# EAGLE design SRAM (EAGLE 6.5.0)
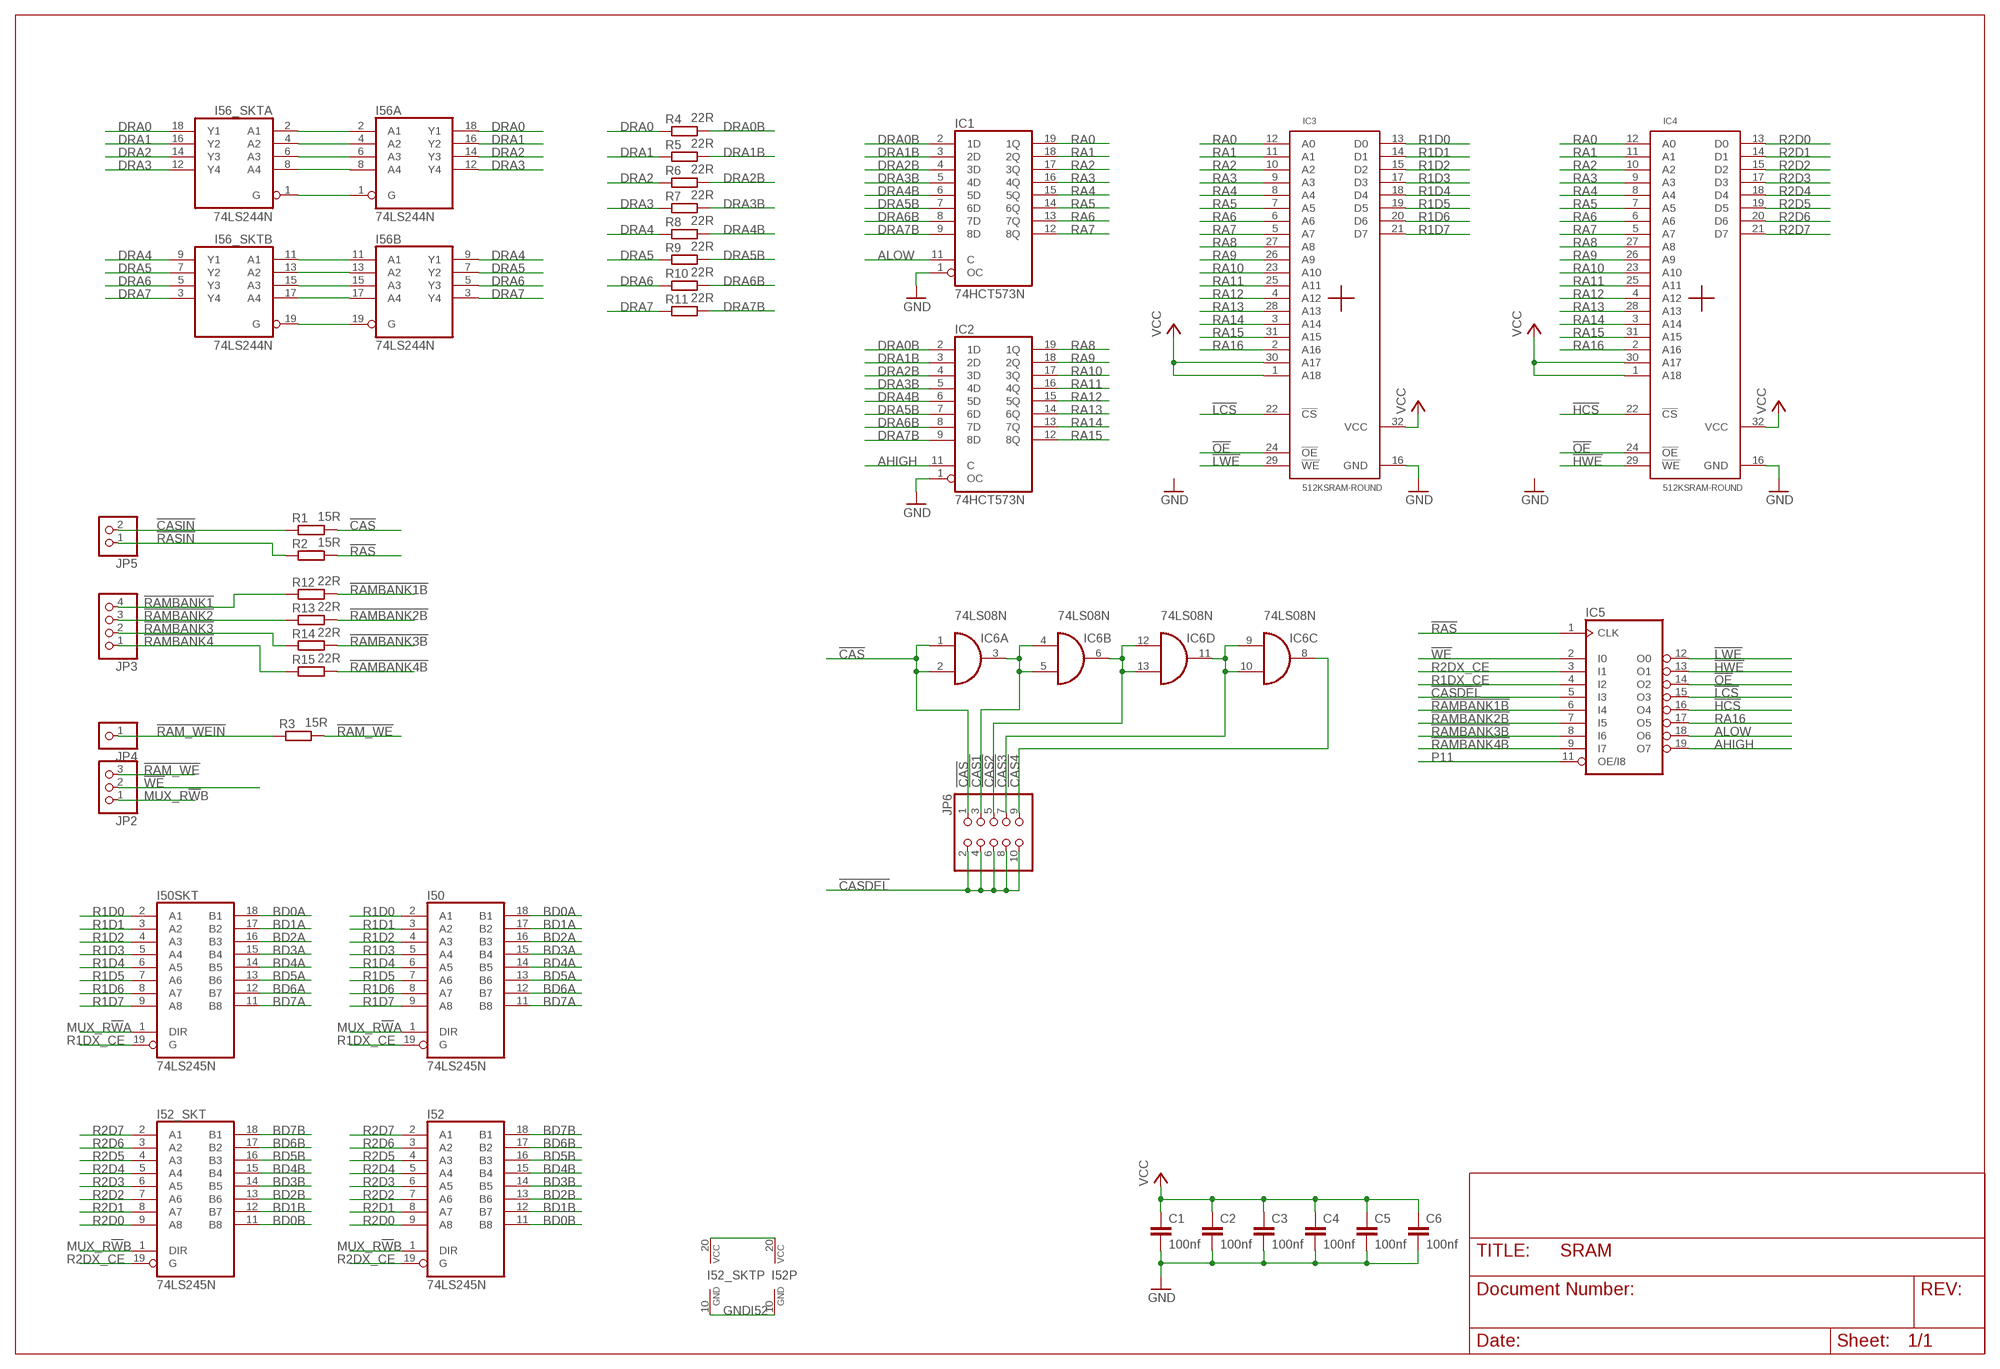
[diagram p0: schematic, sheet 1]

## Parts
C1  100nf  C-EU025-025X050  [C025-025X050]
C2  100nf  C-EU025-025X050  [C025-025X050]
C3  100nf  C-EU025-025X050  [C025-025X050]
C4  100nf  C-EU025-025X050  [C025-025X050]
C5  100nf  C-EU025-025X050  [C025-025X050]
C6  100nf  C-EU025-025X050  [C025-025X050]
I50  74LS245N  [DIL20]
I50SKT  74LS245N  [DIL20]
I52  74LS245N  [DIL20]
I52_SKT  74LS245N  [DIL20]
I56  74LS244N  [DIL20]
I56_SKT  74LS244N  [DIL20]
IC1  74HCT573N  [DIL20]
IC2  74HCT573N  [DIL20]
IC3  512KSRAM-ROUND  [DIL32-ROUND]
IC4  512KSRAM-ROUND  [DIL32-ROUND]
IC5  16V8-ROUND  [DIL20-R]
IC6  74LS08N  [DIL14]
JP2  PINHD-1X3  [1X03]
JP3  PINHD-1X4  [1X04]
JP4  PINHD-1X1  [1X01]
JP5  PINHD-1X2  [1X02]
JP6  PINHD-2X5  [2X05]
R1  15R  R-EU_0204/5  [0204/5]
R2  15R  R-EU_0204/5  [0204/5]
R3  15R  R-EU_0204/5  [0204/5]
R4  22R  R-EU_0204/5  [0204/5]
R5  22R  R-EU_0204/5  [0204/5]
R6  22R  R-EU_0204/5  [0204/5]
R7  22R  R-EU_0204/5  [0204/5]
R8  22R  R-EU_0204/5  [0204/5]
R9  22R  R-EU_0204/5  [0204/5]
R10  22R  R-EU_0204/5  [0204/5]
R11  22R  R-EU_0204/5  [0204/5]
R12  22R  R-EU_0204/5  [0204/5]
R13  22R  R-EU_0204/5  [0204/5]
R14  22R  R-EU_0204/5  [0204/5]
R15  22R  R-EU_0204/5  [0204/5]

## Nets
!CAS: IC6.1(A:I0) IC6.2(A:I1) JP6.1 R1.2
!CAS1: IC6.3(A:O) IC6.4(B:I0) IC6.5(B:I1) JP6.3
!CAS2: IC6.6(B:O) IC6.12(D:I0) IC6.13(D:I1) JP6.5
!CAS3: IC6.9(C:I0) IC6.10(C:I1) IC6.11(D:O) JP6.7
!CAS4: IC6.8(C:O) JP6.9
!CASDEL: IC5.5(I3) JP6.2 JP6.4 JP6.6 JP6.8 JP6.10
!CASIN: JP5.2 R1.1
!HCS: IC4.22(!CS) IC5.16(O4)
!HWE: IC4.29(!WE) IC5.13(O1)
!LCS: IC3.22(!CS) IC5.15(O3)
!LWE: IC3.29(!WE) IC5.12(O0)
!OE: IC3.24(!OE) IC4.24(!OE) IC5.14(O2)
!RAM_WE: JP2.3 R3.2
!RAM_WEIN: JP4.1 R3.1
!RAMBANK1: JP3.4 R12.1
!RAMBANK1B: IC5.6(I4) R12.2
!RAMBANK2: JP3.3 R13.1
!RAMBANK2B: IC5.7(I5) R13.2
!RAMBANK3: JP3.2 R14.1
!RAMBANK3B: IC5.8(I6) R14.2
!RAMBANK4: JP3.1 R15.1
!RAMBANK4B: IC5.9(I7) R15.2
!RAS: IC5.1(CLK) R2.2
!RASIN: JP5.1 R2.1
!WE: IC5.2(I0) JP2.2
AHIGH: IC2.11(C) IC5.19(O7)
ALOW: IC1.11(C) IC5.18(O6)
BD0A: I50.18(B1) I50SKT.18(B1)
BD0B: I52.11(B8) I52_SKT.11(B8)
BD1A: I50.17(B2) I50SKT.17(B2)
BD1B: I52.12(B7) I52_SKT.12(B7)
BD2A: I50.16(B3) I50SKT.16(B3)
BD2B: I52.13(B6) I52_SKT.13(B6)
BD3A: I50.15(B4) I50SKT.15(B4)
BD3B: I52.14(B5) I52_SKT.14(B5)
BD4A: I50.14(B5) I50SKT.14(B5)
BD4B: I52.15(B4) I52_SKT.15(B4)
BD5A: I50.13(B6) I50SKT.13(B6)
BD5B: I52.16(B3) I52_SKT.16(B3)
BD6A: I50.12(B7) I50SKT.12(B7)
BD6B: I52.17(B2) I52_SKT.17(B2)
BD7A: I50.11(B8) I50SKT.11(B8)
BD7B: I52.18(B1) I52_SKT.18(B1)
DRA0: I56.18(A:Y1) I56_SKT.18(A:Y1) R4.1
DRA0B: IC1.2(1D) IC2.2(1D) R4.2
DRA1: I56.16(A:Y2) I56_SKT.16(A:Y2) R5.1
DRA1B: IC1.3(2D) IC2.3(2D) R5.2
DRA2: I56.14(A:Y3) I56_SKT.14(A:Y3) R6.1
DRA2B: IC1.4(3D) IC2.4(3D) R6.2
DRA3: I56.12(A:Y4) I56_SKT.12(A:Y4) R7.1
DRA3B: IC1.5(4D) IC2.5(4D) R7.2
DRA4: I56.9(B:Y1) I56_SKT.9(B:Y1) R8.1
DRA4B: IC1.6(5D) IC2.6(5D) R8.2
DRA5: I56.7(B:Y2) I56_SKT.7(B:Y2) R9.1
DRA5B: IC1.7(6D) IC2.7(6D) R9.2
DRA6: I56.5(B:Y3) I56_SKT.5(B:Y3) R10.1
DRA6B: IC1.8(7D) IC2.8(7D) R10.2
DRA7: I56.3(B:Y4) I56_SKT.3(B:Y4) R11.1
DRA7B: IC1.9(8D) IC2.9(8D) R11.2
GND: C1.2 C2.2 C3.2 C4.2 C5.2 C6.2 IC1.1(OC) IC2.1(OC) IC3.16(GND) IC4.16(GND)
GNDI52: I52.10(GND) I52_SKT.10(GND)
MUX_R!W!A: I50.1(DIR) I50SKT.1(DIR)
MUX_R!W!B: I52.1(DIR) I52_SKT.1(DIR) JP2.1
N$1: I56.11(B:A1) I56_SKT.11(B:A1)
N$2: I56.13(B:A2) I56_SKT.13(B:A2)
N$3: I56.15(B:A3) I56_SKT.15(B:A3)
N$4: I56.17(B:A4) I56_SKT.17(B:A4)
N$5: I56.19(B:G) I56_SKT.19(B:G)
N$6: I56.1(A:G) I56_SKT.1(A:G)
N$7: I56.8(A:A4) I56_SKT.8(A:A4)
N$8: I56.6(A:A3) I56_SKT.6(A:A3)
N$9: I56.4(A:A2) I56_SKT.4(A:A2)
N$10: I56.2(A:A1) I56_SKT.2(A:A1)
P11: IC5.11(OE/I8)
R1D0: I50.2(A1) I50SKT.2(A1) IC3.13(D0)
R1D1: I50.3(A2) I50SKT.3(A2) IC3.14(D1)
R1D2: I50.4(A3) I50SKT.4(A3) IC3.15(D2)
R1D3: I50.5(A4) I50SKT.5(A4) IC3.17(D3)
R1D4: I50.6(A5) I50SKT.6(A5) IC3.18(D4)
R1D5: I50.7(A6) I50SKT.7(A6) IC3.19(D5)
R1D6: I50.8(A7) I50SKT.8(A7) IC3.20(D6)
R1D7: I50.9(A8) I50SKT.9(A8) IC3.21(D7)
R1DX_CE: I50.19(G) I50SKT.19(G) IC5.4(I2)
R2D0: I52.9(A8) I52_SKT.9(A8) IC4.13(D0)
R2D1: I52.8(A7) I52_SKT.8(A7) IC4.14(D1)
R2D2: I52.7(A6) I52_SKT.7(A6) IC4.15(D2)
R2D3: I52.6(A5) I52_SKT.6(A5) IC4.17(D3)
R2D4: I52.5(A4) I52_SKT.5(A4) IC4.18(D4)
R2D5: I52.4(A3) I52_SKT.4(A3) IC4.19(D5)
R2D6: I52.3(A2) I52_SKT.3(A2) IC4.20(D6)
R2D7: I52.2(A1) I52_SKT.2(A1) IC4.21(D7)
R2DX_CE: I52.19(G) I52_SKT.19(G) IC5.3(I1)
RA0: IC1.19(1Q) IC3.12(A0) IC4.12(A0)
RA1: IC1.18(2Q) IC3.11(A1) IC4.11(A1)
RA2: IC1.17(3Q) IC3.10(A2) IC4.10(A2)
RA3: IC1.16(4Q) IC3.9(A3) IC4.9(A3)
RA4: IC1.15(5Q) IC3.8(A4) IC4.8(A4)
RA5: IC1.14(6Q) IC3.7(A5) IC4.7(A5)
RA6: IC1.13(7Q) IC3.6(A6) IC4.6(A6)
RA7: IC1.12(8Q) IC3.5(A7) IC4.5(A7)
RA8: IC2.19(1Q) IC3.27(A8) IC4.27(A8)
RA9: IC2.18(2Q) IC3.26(A9) IC4.26(A9)
RA10: IC2.17(3Q) IC3.23(A10) IC4.23(A10)
RA11: IC2.16(4Q) IC3.25(A11) IC4.25(A11)
RA12: IC2.15(5Q) IC3.4(A12) IC4.4(A12)
RA13: IC2.14(6Q) IC3.28(A13) IC4.28(A13)
RA14: IC2.13(7Q) IC3.3(A14) IC4.3(A14)
RA15: IC2.12(8Q) IC3.31(A15) IC4.31(A15)
RA16: IC3.2(A16) IC4.2(A16) IC5.17(O5)
VCC: C1.1 C2.1 C3.1 C4.1 C5.1 C6.1 IC3.1(A18) IC3.30(A17) IC3.32(VCC) IC4.1(A18) IC4.30(A17) IC4.32(VCC)
VCCI52: I52.20(VCC) I52_SKT.20(VCC)

## Power pins joined to a net without a drawn wire
GND: I50.10(GND) I50SKT.10(GND) I56.10(P:GND) I56_SKT.10(P:GND) IC1.10(GND) IC2.10(GND) IC5.10(GND) IC6.7(P:GND)
VCC: I50.20(VCC) I50SKT.20(VCC) I56.20(P:VCC) I56_SKT.20(P:VCC) IC1.20(VCC) IC2.20(VCC) IC5.20(VCC) IC6.14(P:VCC)

## Library data of the parts
C1-C6 = rcl:C-EU: CAPACITOR, European symbol
I50 I50SKT I52 I52_SKT = 74xx-eu-round:74*245: Octal BUS TRANSCEIVER, 3-state
I56 I56_SKT = 74xx-eu-round:74*244: Octal BUFFER and LINE DRIVER, 3-state
IC1 IC2 = 74xx-eu-round:74*573: 8-bit D latch BUS DRIVER
IC3 IC4 = Rom-Ram:512KSRAM: 512K x 8 SRAM
IC5 = pal-phs:16V8: PAL
IC6 = 74xx-eu-round:74*08: Quad 2-input AND gate
JP2 = pinhead-round:PINHD-1X3: PIN HEADER
JP3 = pinhead-round:PINHD-1X4: PIN HEADER
JP4 = pinhead-round:PINHD-1X1: PIN HEADER
JP5 = pinhead-round:PINHD-1X2: PIN HEADER
JP6 = pinhead-round:PINHD-2X5: PIN HEADER
R1-R15 = rcl:R-EU_: RESISTOR, European symbol

## Board
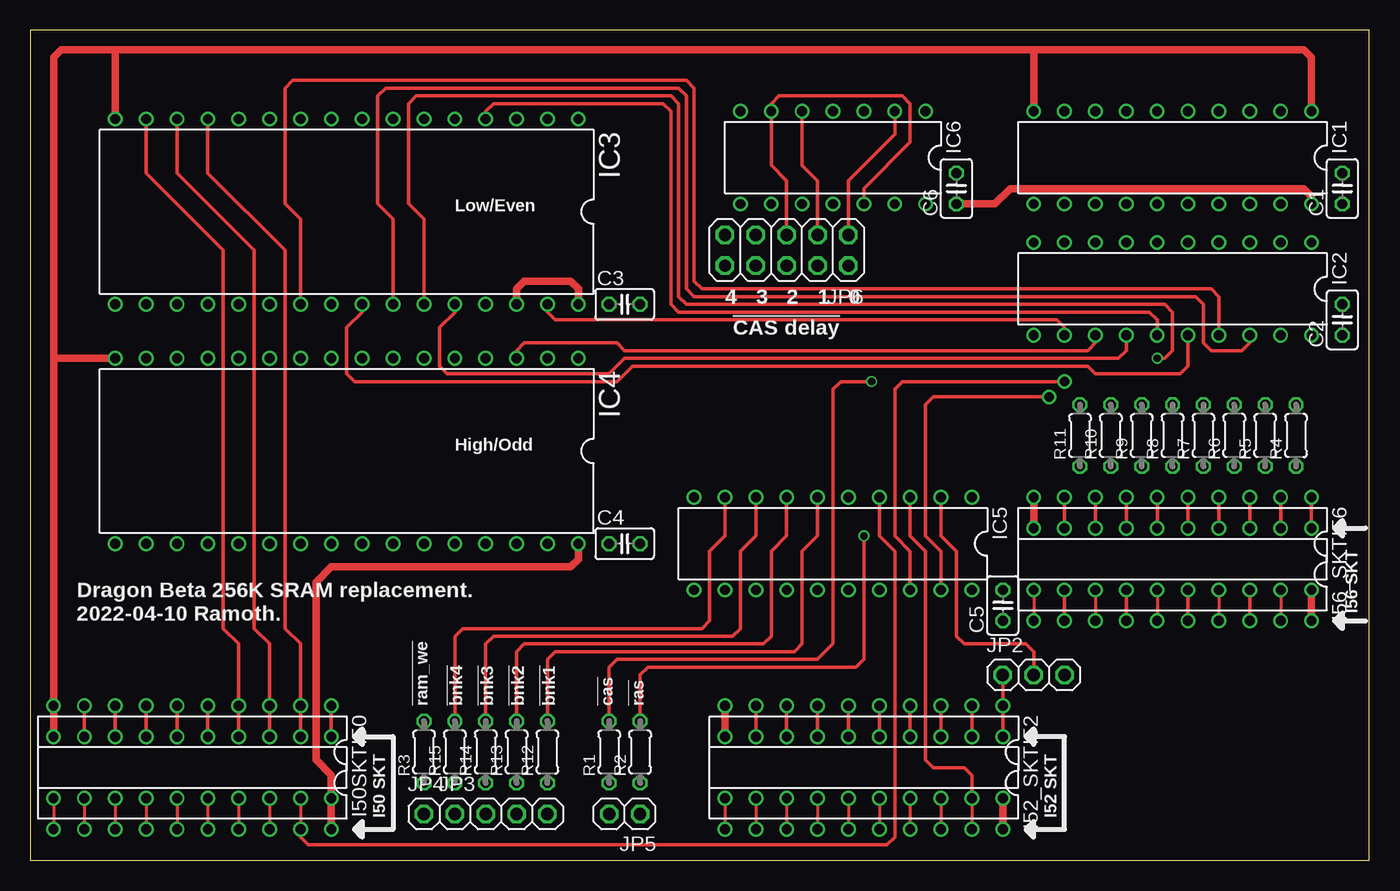
[diagram p1: board, top side]
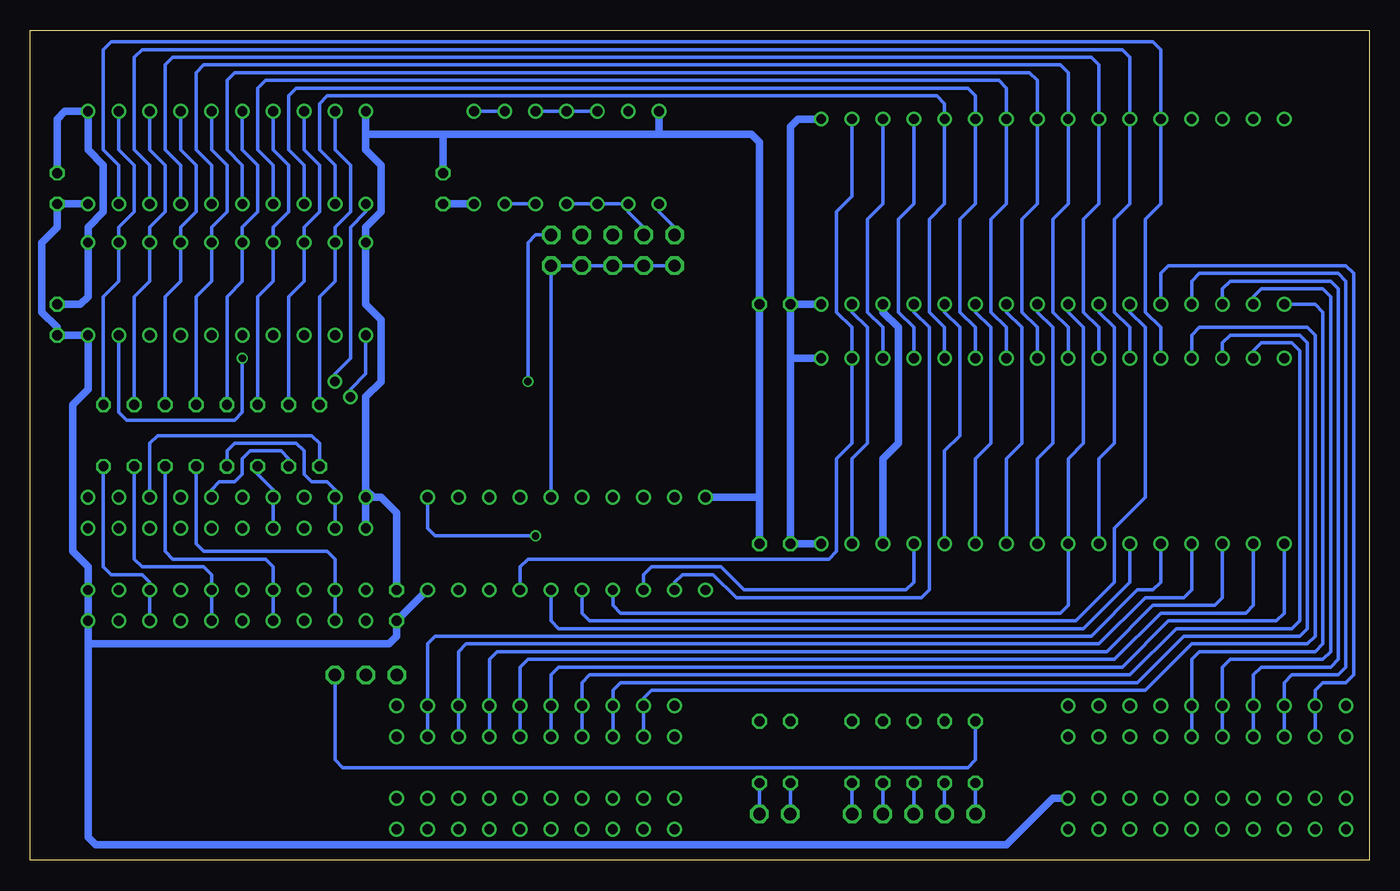
[diagram p2: board, bottom side, seen from below]

Size 110.15 x 68.25 mm. Coordinates in mm from the lower left corner, seen from the top.
Outline: 0,0 110.15,0 110.15,68.25 0,68.25 0,0
Copper layers (1*16): Top 0.035559375mm / dielectric 1.6mm / Bottom 0.035559375mm
Design rules "oshpark-2layer": minimum track width 6mil, minimum drill 10mil, track to track 6mil, track to pad 6mil, pad to pad 6mil, via to via 6mil, smd to smd 6mil, copper to edge 15mil, drill to drill 6mil, minimum pad ring 5mil, minimum via ring 5mil, stop-mask expansion 2.5mil, vias tented up to drill 0mil, thermal gap 10mil

### Footprints (pad centres in the part's own frame; a part is rotated, then mirrored left to right if it is on the bottom)
C025-025X050 = drill 0.813 octagon: 1 -1.27,0; 2 1.27,0
DIL20 = drill 0.813: 1 -11.43,-3.81; 2 -8.89,-3.81; 3 -6.35,-3.81; 4 -3.81,-3.81; 5 -1.27,-3.81; 6 1.27,-3.81; 7 3.81,-3.81; 8 6.35,-3.81; 9 8.89,-3.81; 10 11.43,-3.81; 11 11.43,3.81; 12 8.89,3.81; 13 6.35,3.81; 14 3.81,3.81; 15 1.27,3.81; 16 -1.27,3.81; 17 -3.81,3.81; 18 -6.35,3.81; 19 -8.89,3.81; 20 -11.43,3.81
DIL32-ROUND = drill 0.813: 1 -19.05,-7.62; 2 -16.51,-7.62; 3 -13.97,-7.62; 4 -11.43,-7.62; 5 -8.89,-7.62; 6 -6.35,-7.62; 7 -3.81,-7.62; 8 -1.27,-7.62; 9 1.27,-7.62; 10 3.81,-7.62; 11 6.35,-7.62; 12 8.89,-7.62; 13 11.43,-7.62; 14 13.97,-7.62; 15 16.51,-7.62; 16 19.05,-7.62; 17 19.05,7.62; 18 16.51,7.62; 19 13.97,7.62; 20 11.43,7.62; 21 8.89,7.62; 22 6.35,7.62; 23 3.81,7.62; 24 1.27,7.62; 25 -1.27,7.62; 26 -3.81,7.62; 27 -6.35,7.62; 28 -8.89,7.62; 29 -11.43,7.62; 30 -13.97,7.62; 31 -16.51,7.62; 32 -19.05,7.62
DIL20-R = drill 0.813: 1 -11.43,-3.81; 2 -8.89,-3.81; 3 -6.35,-3.81; 4 -3.81,-3.81; 5 -1.27,-3.81; 6 1.27,-3.81; 7 3.81,-3.81; 8 6.35,-3.81; 9 8.89,-3.81; 10 11.43,-3.81; 11 11.43,3.81; 12 8.89,3.81; 13 6.35,3.81; 14 3.81,3.81; 15 1.27,3.81; 16 -1.27,3.81; 17 -3.81,3.81; 18 -6.35,3.81; 19 -8.89,3.81; 20 -11.43,3.81
DIL14 = drill 0.813: 1 -7.62,-3.81; 2 -5.08,-3.81; 3 -2.54,-3.81; 4 0,-3.81; 5 2.54,-3.81; 6 5.08,-3.81; 7 7.62,-3.81; 8 7.62,3.81; 9 5.08,3.81; 10 2.54,3.81; 11 0,3.81; 12 -2.54,3.81; 13 -5.08,3.81; 14 -7.62,3.81
1X03 = drill 1.016 octagon: 1 -2.54,0; 2 0,0; 3 2.54,0
1X04 = drill 1.016 octagon: 1 -3.81,0; 2 -1.27,0; 3 1.27,0; 4 3.81,0
1X01 = drill 1.016 octagon: 1 0,0
1X02 = drill 1.016 octagon: 1 -1.27,0; 2 1.27,0
2X05 = drill 1.016 octagon: 1 -5.08,-1.27; 2 -5.08,1.27; 3 -2.54,-1.27; 4 -2.54,1.27; 5 0,-1.27; 6 0,1.27; 7 2.54,-1.27; 8 2.54,1.27; 9 5.08,-1.27; 10 5.08,1.27
0204/5 = drill 0.813 octagon: 1 -2.54,0; 2 2.54,0

### Placement (x,y rotation side)
C1  107.95,55.24 90 top
C2  107.95,44.45 90 top
C3  48.9,45.72 0 top
C4  48.9,26.04 0 top
C5  80.01,20.95 90 top
C6  76.2,55.24 90 top
I50  13.34,8.89 180 top
I50SKT  13.34,6.35 180 top
I52  68.58,8.89 180 top
I52_SKT  68.58,6.35 180 top
I56  93.98,26.04 180 top
I56_SKT  93.98,23.5 180 top
IC1  93.98,57.78 180 top
IC2  93.98,46.99 180 top
IC3  26.04,53.34 180 top
IC4  26.04,33.66 180 top
IC5  66.04,26.04 180 top
IC6  66.04,57.78 180 top
JP2  82.55,15.24 0 top
JP3  38.73,3.81 0 top
JP4  32.38,3.81 0 top
JP5  48.9,3.81 180 top
JP6  62.23,50.16 180 top
R1  47.62,8.89 90 top
R2  50.16,8.89 90 top
R3  32.38,8.89 90 top
R4  104.14,34.92 90 top
R5  101.6,34.92 90 top
R6  99.06,34.92 90 top
R7  96.52,34.92 90 top
R8  93.98,34.92 90 top
R9  91.44,34.92 90 top
R10  88.9,34.92 90 top
R11  86.36,34.92 90 top
R12  42.55,8.89 90 top
R13  40.01,8.89 90 top
R14  37.47,8.89 90 top
R15  34.92,8.89 90 top

### Tracks (layer width: path | path; a pad name or v marks a point on that pad's centre or on a via)
!CAS  (via drill 0.6)
  Top 0.305: IC6.2 71.12,59.69 67.31,55.88 JP6.1 | R1.2 47.62,15.88 48.26,16.51 64.77,16.51 66.04,17.78 66.04,38.73 66.67,39.37 v69.22,39.37
  Bottom 0.305: IC6.2 IC6.1 | v69.22,39.37 69.22,50.8 68.58,51.44 JP6.1
!CAS1
  Top 0.305: IC6.5 63.5,57.15 64.77,55.88 JP6.3
  Bottom 0.305: IC6.5 IC6.4 IC6.3
!CAS2
  Top 0.305: JP6.5 62.23,55.88 60.96,57.15 IC6.6 60.96,62.23 61.59,62.87 71.75,62.87 72.39,62.23 72.39,59.05 68.58,55.24 IC6.12
  Bottom 0.305: IC6.12 IC6.13
!CAS3
  Bottom 0.305: IC6.11 IC6.10 IC6.9 60.96,53.34 59.69,52.07 JP6.7
!CAS4
  Bottom 0.305: JP6.9 57.15,52.07 58.42,53.34 IC6.8
!CASDEL
  Bottom 0.305: JP6.10 JP6.8 JP6.6 JP6.4 JP6.2 IC5.5
!CASIN
  Bottom 0.305: JP5.2 R1.1
!HCS
  Bottom 0.305: IC4.22 19.68,22.86 23.5,19.05 66.67,19.05 67.31,19.68 IC5.16
!HWE
  Bottom 0.305: IC4.29 37.47,22.86 38.1,22.23 51.44,22.23 53.34,24.13 59.05,24.13 59.69,23.5 IC5.13
!LCS
  Bottom 0.305: IC3.22 19.68,45.09 18.41,43.81 18.41,29.84 20.95,27.3 20.95,22.86 24.13,19.68 64.14,19.68 64.77,20.32 IC5.15
!LWE
  Bottom 0.305: IC3.29 37.47,45.09 36.2,43.81 36.2,22.23 36.83,21.59 52.07,21.59 53.98,23.5 56.52,23.5 57.15,22.86 IC5.12
!OE
  Bottom 0.305: IC3.24 24.77,45.09 23.5,43.81 23.5,34.29 24.77,33.02 IC4.24 24.77,20.95 25.4,20.32 61.59,20.32 62.23,20.95 IC5.14
!RAM_WE
  Bottom 0.305: JP2.3 85.09,8.26 84.45,7.62 33.02,7.62 32.38,8.26 R3.2
!RAM_WEIN
  Bottom 0.305: JP4.1 R3.1
!RAMBANK1
  Bottom 0.305: JP3.4 R12.1
!RAMBANK1B
  Top 0.305: R12.2 42.55,16.51 43.18,17.14 62.87,17.14 63.5,17.78 63.5,25.4 64.77,26.67 IC5.6
!RAMBANK2
  Bottom 0.305: JP3.3 R13.1
!RAMBANK2B
  Top 0.305: R13.2 40.01,17.14 40.64,17.78 60.33,17.78 60.96,18.41 60.96,25.4 62.23,26.67 IC5.7
!RAMBANK3
  Bottom 0.305: JP3.2 R14.1
!RAMBANK3B
  Top 0.305: R14.2 37.47,17.78 38.1,18.41 57.78,18.41 58.42,19.05 58.42,25.4 59.69,26.67 IC5.8
!RAMBANK4
  Bottom 0.305: JP3.1 R15.1
!RAMBANK4B
  Top 0.305: R15.2 34.92,18.41 35.56,19.05 55.24,19.05 55.88,19.68 55.88,25.4 57.15,26.67 IC5.9
!RAS  (via drill 0.6)
  Top 0.305: R2.2 50.16,15.24 50.8,15.88 67.94,15.88 68.58,16.51 v68.58,26.67
  Bottom 0.305: v68.58,26.67 76.83,26.67 77.47,27.3 IC5.1
!RASIN
  Bottom 0.305: JP5.1 R2.1
!WE
  Top 0.305: IC5.2 74.93,26.67 76.2,25.4 76.2,18.41 76.83,17.78 81.92,17.78 82.55,17.14 JP2.2
AHIGH  (via drill 0.8)
  Top 0.305: v83.82,38.1 74.3,38.1 73.66,37.47 73.66,26.67 74.93,25.4 IC5.19
  Bottom 0.305: v83.82,38.1 83.82,38.73 82.55,40.01 IC2.11
ALOW  (via drill 0.8)
  Top 0.305: v85.09,39.37 71.75,39.37 71.12,38.73 71.12,26.67 72.39,25.4 IC5.18
  Bottom 0.305: IC1.11 82.55,53.34 83.82,52.07 83.82,41.27 85.09,40.01 v85.09,39.37
BD0A
  Top 0.254: I50.18 I50SKT.18
BD0B
  Top 0.254: I52.11 I52_SKT.11
BD1A
  Top 0.254: I50.17 I50SKT.17
BD1B
  Top 0.254: I52.12 I52_SKT.12
BD2A
  Top 0.254: I50.16 I50SKT.16
BD2B
  Top 0.254: I52.13 I52_SKT.13
BD3A
  Top 0.254: I50.15 I50SKT.15
BD3B
  Top 0.254: I52.14 I52_SKT.14
BD4A
  Top 0.254: I50.14 I50SKT.14
BD4B
  Top 0.254: I52.15 I52_SKT.15
BD5A
  Top 0.254: I50.13 I50SKT.13
BD5B
  Top 0.254: I52.16 I52_SKT.16
BD6A
  Top 0.254: I50.12 I50SKT.12
BD6B
  Top 0.254: I52.17 I52_SKT.17
BD7A
  Top 0.254: I50.11 I50SKT.11
BD7B
  Top 0.254: I52.18 I52_SKT.18
DRA0
  Top 0.305: I56_SKT.18 I56.18
  Bottom 0.305: I56_SKT.18 I56.18 100.33,22.86 100.97,23.5 103.5,23.5 104.14,24.13 R4.1
DRA0B
  Bottom 0.305: R4.2 104.14,46.35 102.87,47.62 IC2.2 102.87,52.07 101.6,53.34 101.6,57.15 102.87,58.42 IC1.2
DRA1
  Top 0.305: I56_SKT.16 I56.16
  Bottom 0.305: I56_SKT.16 I56.16 95.25,23.5 95.89,24.13 100.97,24.13 101.6,24.77 R5.1
DRA1B
  Bottom 0.305: R5.2 101.6,46.35 100.33,47.62 IC2.3 100.33,52.07 99.06,53.34 99.06,57.15 100.33,58.42 IC1.3
DRA2
  Top 0.305: I56_SKT.14 I56.14
  Bottom 0.305: I56_SKT.14 I56.14 90.17,24.13 90.81,24.77 98.42,24.77 99.06,25.4 R6.1
DRA2B
  Bottom 0.305: R6.2 99.06,46.35 97.79,47.62 IC2.4 97.79,52.07 96.52,53.34 96.52,57.15 97.79,58.42 IC1.4
DRA3
  Top 0.305: I56_SKT.12 I56.12
  Bottom 0.305: I56_SKT.12 I56.12 85.09,24.77 85.72,25.4 95.89,25.4 96.52,26.04 R7.1
DRA3B
  Bottom 0.305: R7.2 96.52,46.35 95.25,47.62 IC2.5 95.25,52.07 93.98,53.34 93.98,57.15 95.25,58.42 IC1.5
DRA4
  Top 0.305: I56.9 I56_SKT.9
  Bottom 0.305: I56_SKT.9 I56.9 85.09,30.48 85.72,31.11 87,31.11 87.63,31.75 87.63,33.66 88.27,34.29 93.34,34.29 93.98,33.66 R8.1
DRA4B
  Bottom 0.305: R8.2 93.98,46.35 92.71,47.62 IC2.6 92.71,52.07 91.44,53.34 91.44,57.15 92.71,58.42 IC1.6
DRA5
  Top 0.305: I56_SKT.7 I56.7
  Bottom 0.305: I56_SKT.7 I56.7 90.17,30.48 91.44,31.75 R9.1
DRA5B
  Bottom 0.305: R9.2 91.44,46.35 90.17,47.62 IC2.7 90.17,52.07 88.9,53.34 88.9,57.15 90.17,58.42 IC1.7
DRA6
  Top 0.305: I56_SKT.5 I56.5
  Bottom 0.305: R10.1 88.9,33.02 89.53,33.66 92.08,33.66 92.71,33.02 92.71,31.75 93.34,31.11 94.61,31.11 95.25,30.48 I56.5
DRA6B
  Bottom 0.305: R10.2 88.9,46.35 87.63,47.62 IC2.8 87.63,52.07 86.36,53.34 86.36,57.15 87.63,58.42 IC1.8
DRA7
  Top 0.305: I56_SKT.3 I56.3
  Bottom 0.305: R11.1 86.36,34.29 87,34.92 99.69,34.92 100.33,34.29 I56.3
DRA7B
  Bottom 0.305: R11.2 86.36,46.35 85.09,47.62 IC2.9 85.09,52.07 83.82,53.34 83.82,57.15 85.09,58.42 IC1.9
GND
  Top 0.61: I50SKT.10 I50.10 1.91,41.27 | I56_SKT.10 I56.10 | 1.91,41.27 1.91,66.04 2.54,66.67 6.99,66.67 | IC1.1 105.41,66.04 104.78,66.67 82.55,66.67 | 82.55,66.67 6.99,66.67 | IC3.16 6.99,66.67 | IC1.10 82.55,66.67 | IC4.16 1.91,41.27
  Bottom 0.61: 50.16,29.84 C3.2 50.16,59.05 50.8,59.69 58.42,59.69 | 50.16,29.84 C4.2 | 58.42,59.69 76.2,59.69 | 76.2,59.69 82.55,59.69 | 82.55,30.48 82.55,38.1 81.28,39.37 81.28,44.45 82.55,45.72 IC2.10 82.55,52.07 81.28,53.34 81.28,57.15 82.55,58.42 82.55,59.69 | 82.55,30.48 I56.10 I56_SKT.10 | C5.2 80.01,28.57 81.28,29.84 81.92,29.84 82.55,30.48 | C1.2 107.95,60.96 107.31,61.59 IC1.1 105.41,58.42 104.14,57.15 104.14,53.34 105.41,52.07 IC2.1 105.41,46.35 106.05,45.72 C2.2 | IC5.10 50.16,29.84 | 82.55,59.69 IC1.10 | C6.2 76.2,59.69 | IC6.7 58.42,59.69
GNDI52
  Top 0.61: I52.10 I52_SKT.10
MUX_R!W!A
  Top 0.305: I50.1 I50SKT.1
MUX_R!W!B
  Top 0.305: I52_SKT.1 I52.1 JP2.1
N$1
  Top 0.254: I56.11 I56_SKT.11
N$2
  Top 0.254: I56.13 I56_SKT.13
N$3
  Top 0.254: I56.15 I56_SKT.15
N$4
  Top 0.254: I56.17 I56_SKT.17
N$5
  Top 0.254: I56.19 I56_SKT.19
N$6
  Top 0.305: I56_SKT.1 I56.1
N$7
  Top 0.305: I56_SKT.8 I56.8
N$8
  Top 0.305: I56_SKT.6 I56.6
N$9
  Top 0.305: I56_SKT.4 I56.4
N$10
  Top 0.305: I56_SKT.2 I56.2
R1D0
  Top 0.305: I50SKT.2 I50.2 22.23,17.78 20.95,19.05 20.95,50.16 14.61,56.52 IC3.13
R1D1
  Top 0.305: I50SKT.3 I50.3 19.68,17.78 18.41,19.05 18.41,50.16 12.06,56.52 IC3.14
R1D2
  Top 0.305: I50SKT.4 I50.4 17.14,17.78 15.88,19.05 15.88,50.16 9.53,56.52 IC3.15
R1D3
  Top 0.305: I50SKT.5 I50.5
  Bottom 0.305: IC3.17 4.45,45.72 3.81,45.09 3.81,17.78 4.45,17.14 13.97,17.14 14.61,16.51 I50.5 I50SKT.5
R1D4
  Top 0.305: I50SKT.6 I50.6
  Bottom 0.305: IC3.18 9.53,46.35 8.89,46.99 3.81,46.99 3.17,46.35 3.17,17.14 3.81,16.51 11.43,16.51 12.06,15.88 I50.6 I50SKT.6
R1D5
  Top 0.305: I50SKT.7 I50.7
  Bottom 0.305: IC3.19 12.06,46.99 11.43,47.62 3.17,47.62 2.54,46.99 2.54,16.51 3.17,15.88 8.89,15.88 9.53,15.24 I50.7 I50SKT.7
R1D6
  Top 0.305: I50SKT.8 I50.8
  Bottom 0.305: IC3.20 14.61,47.62 13.97,48.26 2.54,48.26 1.91,47.62 1.91,15.88 2.54,15.24 6.35,15.24 6.99,14.61 I50.8 I50SKT.8
R1D7
  Top 0.305: I50SKT.9 I50.9
  Bottom 0.305: IC3.21 17.14,48.26 16.51,48.9 1.91,48.9 1.27,48.26 1.27,15.24 1.91,14.61 3.81,14.61 4.45,13.97 I50.9 I50SKT.9
R1DX_CE
  Top 0.254: I50.19 I50SKT.19
  Top 0.305: I50SKT.19 22.23,1.91 22.86,1.27 70.48,1.27 71.12,1.91 71.12,25.4 69.85,26.67 IC5.4
R2D0
  Top 0.305: I52.9 I52_SKT.9
  Bottom 0.305: I52_SKT.9 I52.9 59.69,13.34 59.05,13.97 18.41,13.97 14.61,17.78 5.08,17.78 4.45,18.41 4.45,43.18 5.08,43.81 13.97,43.81 14.61,43.18 IC4.13
R2D1
  Top 0.305: I52.8 I52_SKT.8
  Bottom 0.305: I52_SKT.8 I52.8 62.23,13.97 61.59,14.61 19.05,14.61 15.24,18.41 5.71,18.41 5.08,19.05 5.08,42.55 5.71,43.18 11.43,43.18 12.06,42.55 IC4.14
R2D2
  Top 0.305: I52.7 I52_SKT.7
  Bottom 0.305: I52_SKT.7 I52.7 64.77,14.61 64.14,15.24 19.68,15.24 15.88,19.05 6.35,19.05 5.71,19.68 5.71,41.91 6.35,42.55 8.89,42.55 9.53,41.91 IC4.15
R2D3
  Top 0.305: I52.6 I52_SKT.6
  Bottom 0.305: IC4.17 6.99,20.32 7.62,19.68 16.51,19.68 20.32,15.88 66.67,15.88 67.31,15.24 I52.6 I52_SKT.6
R2D4
  Top 0.305: I52.5 I52_SKT.5
  Bottom 0.305: IC4.18 9.53,20.95 10.16,20.32 17.14,20.32 20.95,16.51 69.22,16.51 69.85,15.88 I52.5 I52_SKT.5
R2D5
  Top 0.305: I52.4 I52_SKT.4
  Bottom 0.305: IC4.19 12.06,21.59 12.7,20.95 17.78,20.95 21.59,17.14 71.75,17.14 72.39,16.51 I52.4 I52_SKT.4
R2D6
  Top 0.305: I52.3 I52_SKT.3
  Bottom 0.305: IC4.20 14.61,22.23 15.24,21.59 18.41,21.59 22.23,17.78 74.3,17.78 74.93,17.14 I52.3 I52_SKT.3
R2D7
  Top 0.305: I52.2 I52_SKT.2
  Bottom 0.305: IC4.21 17.14,22.86 17.78,22.23 19.05,22.23 22.86,18.41 76.83,18.41 77.47,17.78 I52.2 I52_SKT.2
R2DX_CE
  Top 0.254: I52.19 I52_SKT.19
  Top 0.305: IC5.3 72.39,26.67 73.66,25.4 73.66,8.26 74.3,7.62 76.83,7.62 77.47,6.99 I52.19
RA0
  Bottom 0.305: IC1.19 102.87,57.15 104.14,58.42 104.14,66.67 103.5,67.31 17.78,67.31 17.14,66.67 IC3.12 17.14,53.98 18.41,52.7 18.41,45.09 17.14,43.81 IC4.12
RA1
  Bottom 0.305: IC1.18 100.33,57.15 101.6,58.42 101.6,66.04 100.97,66.67 20.32,66.67 19.68,66.04 IC3.11 19.68,53.98 20.95,52.7 20.95,45.09 19.68,43.81 IC4.11
RA2
  Bottom 0.305: IC1.17 97.79,57.15 99.06,58.42 99.06,65.41 98.42,66.04 22.86,66.04 22.23,65.41 IC3.10 22.23,53.98 23.5,52.7 23.5,45.09 22.23,43.81 IC4.10
RA3
  Bottom 0.305: IC1.16 95.25,57.15 96.52,58.42 96.52,64.77 95.89,65.41 25.4,65.41 24.77,64.77 IC3.9 24.77,53.98 26.04,52.7 26.04,45.09 24.77,43.81 IC4.9
RA4
  Bottom 0.305: IC1.15 92.71,57.15 93.98,58.42 93.98,64.14 93.34,64.77 27.94,64.77 27.3,64.14 IC3.8 27.3,53.98 28.57,52.7 28.57,45.09 27.3,43.81 IC4.8
RA5
  Bottom 0.305: IC1.14 90.17,57.15 91.44,58.42 91.44,63.5 90.81,64.14 30.48,64.14 29.84,63.5 IC3.7 29.84,53.98 31.11,52.7 31.11,45.09 29.84,43.81 IC4.7
RA6
  Bottom 0.305: IC1.13 87.63,57.15 88.9,58.42 88.9,62.87 88.27,63.5 33.02,63.5 32.38,62.87 IC3.6 32.38,53.98 33.66,52.7 33.66,45.09 32.38,43.81 IC4.6
RA7
  Bottom 0.305: IC1.12 85.09,57.15 86.36,58.42 86.36,62.23 85.72,62.87 35.56,62.87 34.92,62.23 IC3.5 34.92,53.98 36.2,52.7 36.2,45.09 34.92,43.81 IC4.5
RA8  (via drill 0.6)
  Top 0.305: v92.71,41.27 93.34,41.27 93.98,41.91 93.98,45.09 93.34,45.72 53.98,45.72 53.34,46.35 53.34,62.23 52.7,62.87 31.75,62.87 31.11,62.23 31.11,53.98 32.38,52.7 IC3.27
  Bottom 0.305: IC3.27 32.38,45.09 31.11,43.81 31.11,34.29 32.38,33.02 IC4.27 | IC2.19 102.87,36.83 102.23,36.2 93.34,36.2 92.71,36.83 v92.71,41.27
RA9
  Top 0.305: IC2.18 100.33,42.55 99.69,41.91 97.16,41.91 96.52,42.55 96.52,45.72 95.89,46.35 54.61,46.35 53.98,46.99 53.98,62.87 53.34,63.5 29.21,63.5 28.57,62.87 28.57,53.98 29.84,52.7 IC3.26
  Bottom 0.305: IC3.26 29.84,45.09 28.57,43.81 28.57,34.29 29.84,33.02 IC4.26
RA10
  Top 0.305: IC2.17 97.79,46.35 97.16,46.99 55.24,46.99 54.61,47.62 54.61,63.5 53.98,64.14 21.59,64.14 20.95,63.5 20.95,53.98 22.23,52.7 IC3.23
  Bottom 0.305: IC3.23 22.23,45.09 20.95,43.81 20.95,34.29 22.23,33.02 IC4.23
RA11
  Top 0.305: IC2.16 95.25,40.64 94.61,40.01 87.63,40.01 87,40.64 49.53,40.64 48.26,39.37 26.67,39.37 26.04,40.01 26.04,43.81 27.3,45.09 IC3.25
  Bottom 0.305: IC3.25 27.3,45.09 26.04,43.81 26.04,34.29 27.3,33.02 IC4.25
RA12
  Top 0.305: IC2.15 92.71,44.45 92.08,45.09 53.34,45.09 52.7,45.72 52.7,61.59 52.07,62.23 38.1,62.23 37.47,61.59 IC3.4
  Bottom 0.305: IC3.4 37.47,53.98 38.73,52.7 38.73,45.09 37.47,43.81 IC4.4
RA13
  Top 0.305: IC2.14 90.17,41.91 89.53,41.27 48.9,41.27 47.62,40.01 34.29,40.01 33.66,40.64 33.66,43.81 34.92,45.09 IC3.28
  Bottom 0.305: IC3.28 34.92,45.09 33.66,43.81 33.66,34.92 34.92,33.66 IC4.28
RA14
  Top 0.305: IC2.13 87.63,42.55 87,41.91 48.9,41.91 48.26,42.55 40.64,42.55 40.01,41.91 IC4.3
  Bottom 0.305: IC3.3 40.01,53.98 41.27,52.7 41.27,45.09 40.01,43.81 IC4.3
RA15
  Top 0.305: IC2.12 85.09,43.81 84.45,44.45 43.18,44.45 42.55,45.09 IC3.31
  Bottom 0.305: IC3.31 42.55,45.09 41.27,43.81 41.27,34.29 42.55,33.02 IC4.31
RA16
  Bottom 0.305: IC3.2 42.55,54.61 43.81,53.34 43.81,45.09 42.55,43.81 IC4.2 42.55,34.29 43.81,33.02 43.81,25.4 44.45,24.77 69.22,24.77 69.85,24.13 IC5.17
VCC
  Top 0.61: I56.20 I56_SKT.20 | I50SKT.20 I50.20 24.77,6.99 23.5,8.26 23.5,22.86 24.77,24.13 44.45,24.13 45.09,24.77 IC4.32 | C6.1 79.38,53.98 80.64,55.24 104.78,55.24 105.41,54.61 IC1.20 | IC3.30 40.01,46.99 40.64,47.62 44.45,47.62 45.09,46.99 IC3.32
  Bottom 0.61: IC1.20 C1.1 107.95,52.07 109.22,50.8 109.22,45.09 107.95,43.81 C2.1 IC2.20 105.41,38.73 106.68,37.47 106.68,25.4 105.41,24.13 I56.20 I56_SKT.20 105.41,17.78 | IC3.32 C3.1 | C3.1 47.62,41.27 | 47.62,41.27 C4.1 IC4.32 | I50.20 26.04,5.08 29.84,1.27 104.78,1.27 105.41,1.91 105.41,17.78 | IC5.20 C5.1 80.01,18.41 80.64,17.78 105.41,17.78 | IC4.1 47.62,41.27 | IC3.1 46.99,60.96 47.62,60.33 C3.1 | IC3.30 40.01,45.09 38.73,43.81 38.73,34.29 40.01,33.02 IC4.30 | IC6.14 C6.1
VCCI52
  Top 0.61: I52.20 I52_SKT.20

### Text on the board
tPlace: Low/Even | 4 | 3 | 2 | 1 | 0 | !CAS delay | High/Odd | Dragon Beta 256K SRAM replacement. / 2022-04-10 Ramoth. | I56 SKT | !ram_we | !bnk4 | !bnk3 | !bnk2 | !bnk1 | !cas | !ras | I50 SKT | I52 SKT
Document: RA18 | A19 | 3b | 2b | 3b | 2b | GND | A4 | A5 | A6 | A7 | !LWE | !OE | !RAMCS | LOW | HIGH | A3 | A2 | A1 | A0 | VCC | D7 | D6 | D5 | D4 | D3 | D2 | D1 | D0